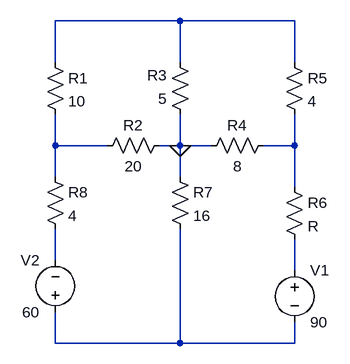
[diagram p0: schematic Draft33.asc]
Draft33.asc, the LTspice schematic file:
Version 4
SHEET 1 880 680
WIRE 272 16 80 16
WIRE 448 16 272 16
WIRE 80 80 80 16
WIRE 272 80 272 16
WIRE 448 80 448 16
WIRE 80 208 80 160
WIRE 160 208 80 208
WIRE 272 208 272 160
WIRE 272 208 240 208
WIRE 320 208 272 208
WIRE 448 208 448 160
WIRE 448 208 400 208
WIRE 80 256 80 208
WIRE 272 256 272 208
WIRE 448 272 448 208
WIRE 80 384 80 336
WIRE 448 400 448 352
WIRE 80 512 80 464
WIRE 272 512 272 336
WIRE 272 512 80 512
WIRE 448 512 448 480
WIRE 448 512 272 512
FLAG 272 208 0
SYMBOL res 64 64 R0
SYMATTR InstName R1
SYMATTR Value 10
SYMBOL res 256 192 R90
WINDOW 0 0 56 VBottom 2
WINDOW 3 32 56 VTop 2
SYMATTR InstName R2
SYMATTR Value 20
SYMBOL res 288 176 R180
WINDOW 0 36 76 Left 2
WINDOW 3 36 40 Left 2
SYMATTR InstName R3
SYMATTR Value 5
SYMBOL res 304 224 R270
WINDOW 0 32 56 VTop 2
WINDOW 3 0 56 VBottom 2
SYMATTR InstName R4
SYMATTR Value 8
SYMBOL res 432 64 R0
SYMATTR InstName R5
SYMATTR Value 4
SYMBOL res 432 256 R0
SYMATTR InstName R6
SYMBOL res 256 240 R0
SYMATTR InstName R7
SYMATTR Value 16
SYMBOL res 64 240 R0
SYMATTR InstName R8
SYMATTR Value 4
SYMBOL voltage 448 384 R0
SYMATTR InstName V1
SYMATTR Value 90
SYMBOL voltage 80 480 R180
WINDOW 0 24 96 Left 2
WINDOW 3 24 16 Left 2
SYMATTR InstName V2
SYMATTR Value 60

The netlist it stands for:
* Draft33.asc
R1 N001 N002 10
R2 0 N002 20
R3 0 N001 5
R4 0 N003 8
R5 N001 N003 4
R6 N003 N005 R
R7 0 N006 16
R8 N002 N004 4
V1 N005 N006 90
V2 N006 N004 60
.backanno
.end